# Altium schematic sheet Electronics_power_supply_DC_converter.SchDoc: Electronics power supply
size A3; SheetNumber: 2; SheetTotal: 6
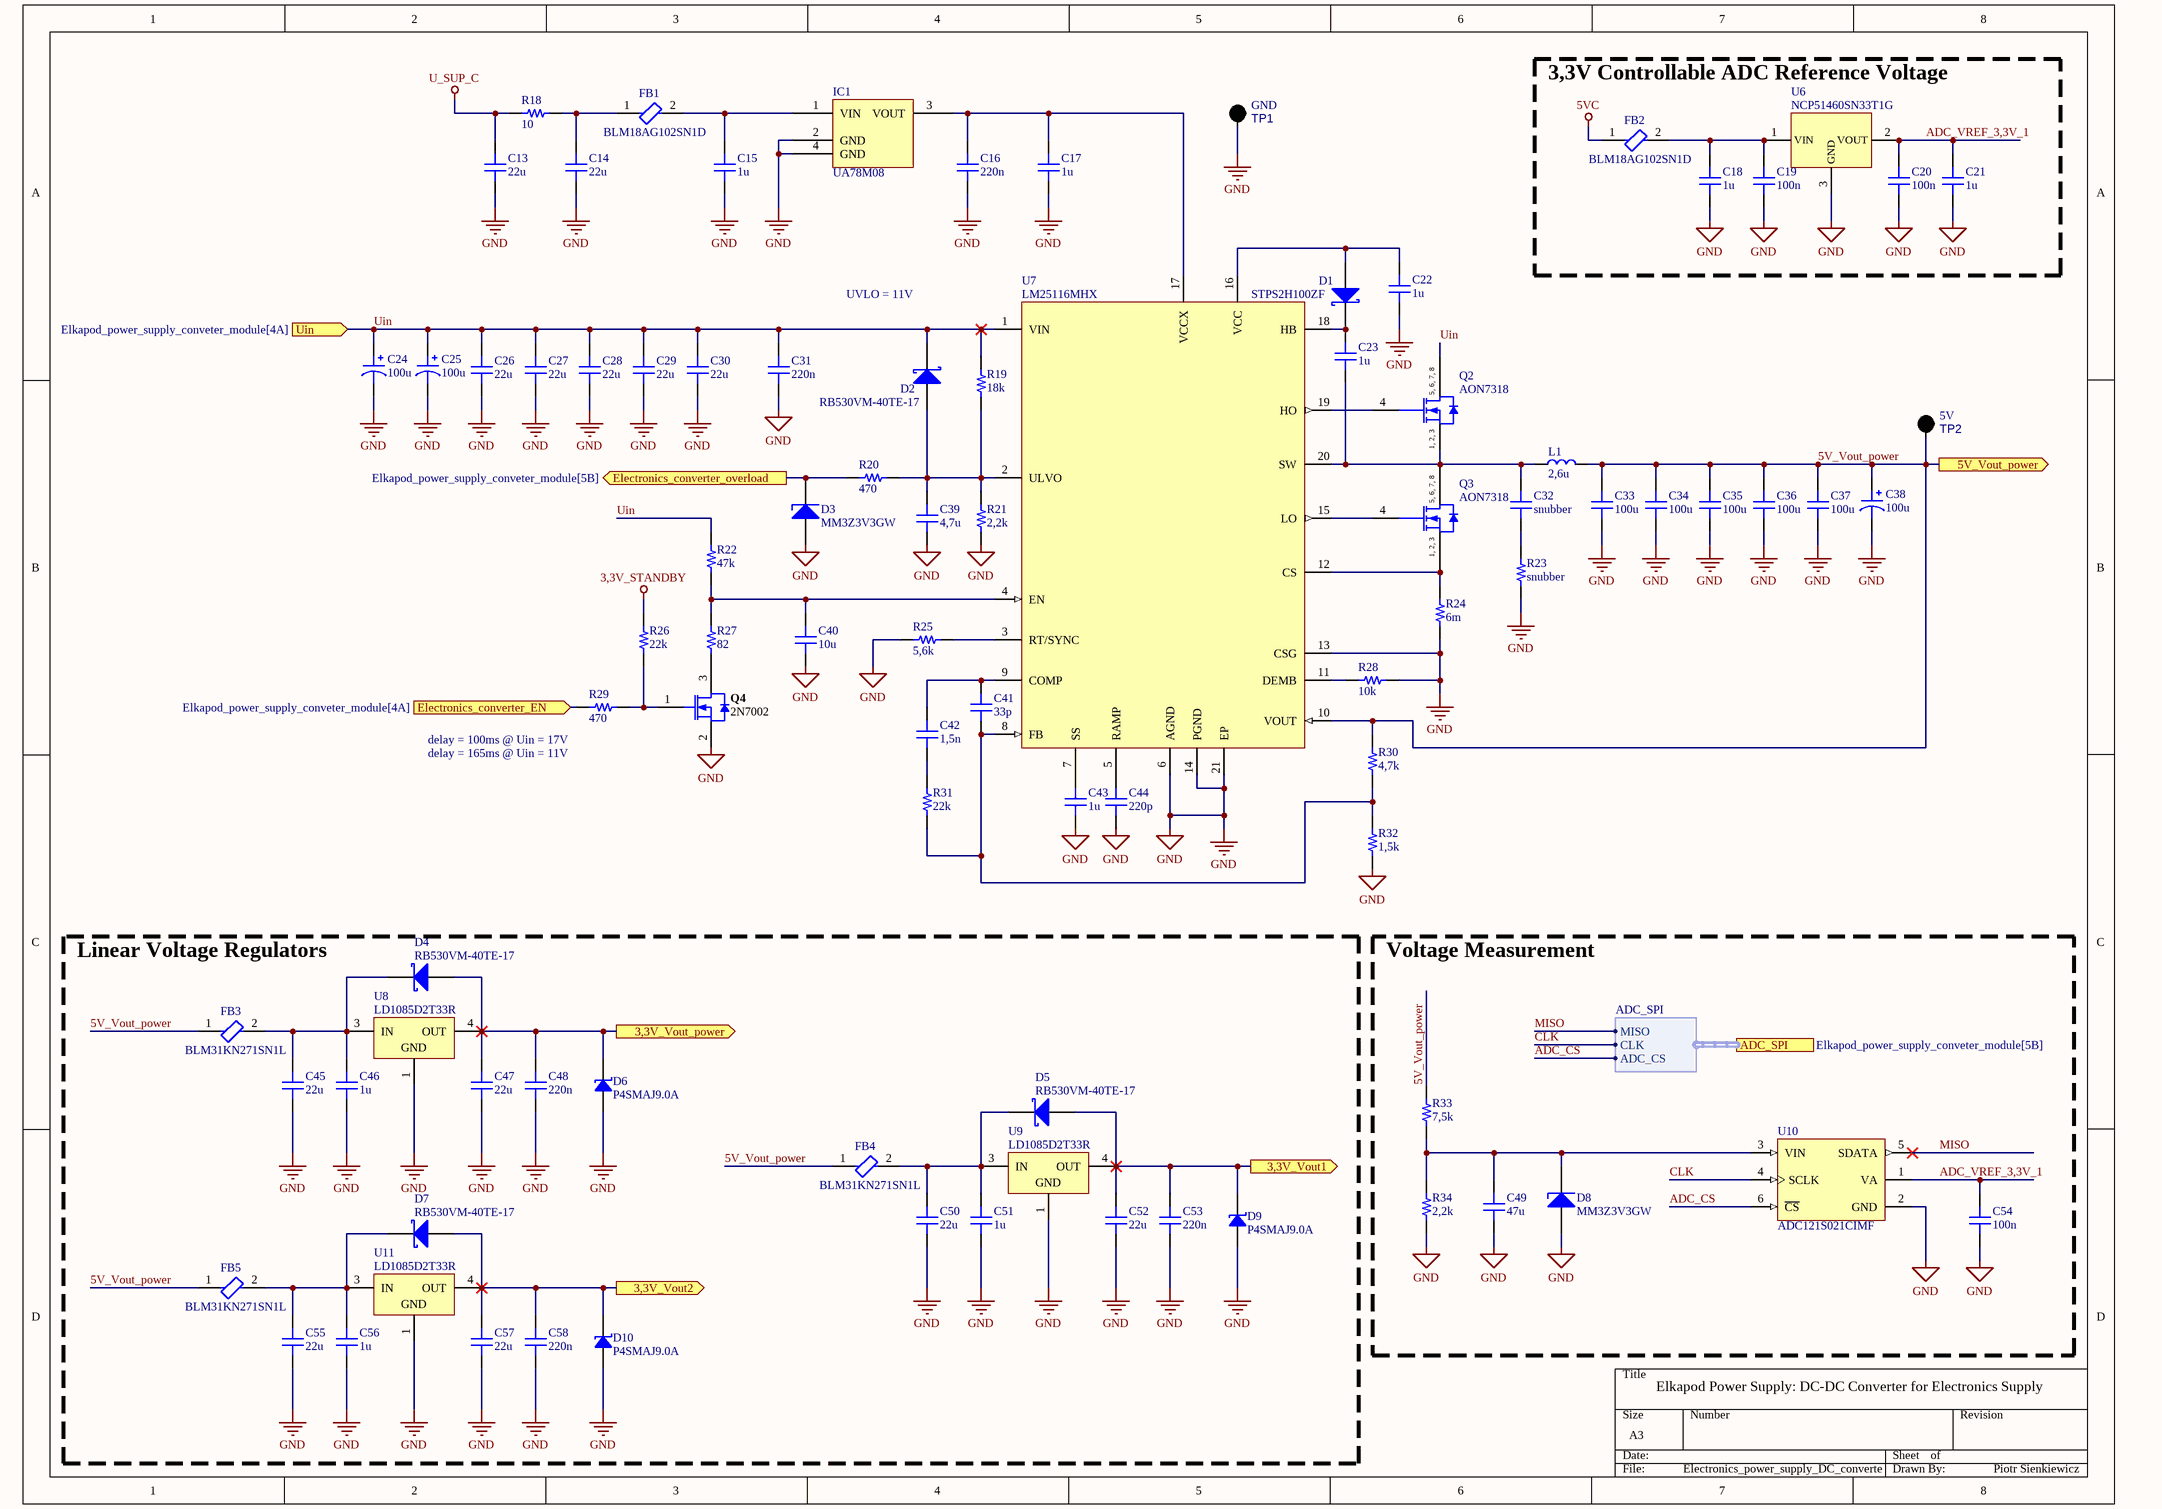
[diagram p0: Electronics_power_supply_DC_converter.SchDoc]

## Parts
C13  22u  [CAP 0805_2012]
C14  22u  [CAP 0805_2012]
C15  1u  [CAP 0603_1608]
C16  220n  [CAP 0603_1608]
C17  1u  [CAP 0603_1608]
C18  1u  [CAP 0603_1608]
C19  100n  [CAP 0603_1608]
C20  100n  [CAP 0603_1608]
C21  1u  [CAP 0603_1608]
C22  1u  [CAP 0603_1608]
C23  1u  [CAP 0603_1608]
C24  100u  [CAP ALSMD 8.3MM H10.5MM]
C25  100u  [CAP ALSMD 8.3MM H10.5MM]
C26  22u  [CAP 0805_2012]
C27  22u  [CAP 0805_2012]
C28  22u  [CAP 0805_2012]
C29  22u  [CAP 0805_2012]
C30  22u  [CAP 0805_2012]
C31  220n  [CAP 0603_1608]
C32  snubber  [CAP 0603_1608]
C33  100u  [CAP 1210_3225 - 1MM]
C34  100u  [CAP 1210_3225 - 1MM]
C35  100u  [CAP 1210_3225 - 1MM]
C36  100u  [CAP 1210_3225 - 1MM]
C37  100u  [CAP 1210_3225 - 1MM]
C38  100u  [CAP ALSMD 8.3MM H10.5MM]
C39  4,7u  [CAP 0603_1608]
C40  10u  [CAP 0603_1608]
C41  33p  [CAP 0603_1608]
C42  1,5n  [CAP 0603_1608]
C43  1u  [CAP 0603_1608]
C44  220p  [CAP 0603_1608]
C45  22u  [CAP 0805_2012]
C46  1u  [CAP 0603_1608]
C47  22u  [CAP 0805_2012]
C48  220n  [CAP 0603_1608]
C49  47u  [CAP 0603_1608]
C50  22u  [CAP 0805_2012]
C51  1u  [CAP 0603_1608]
C52  22u  [CAP 0805_2012]
C53  220n  [CAP 0603_1608]
C54  100n  [CAP 0603_1608]
C55  22u  [CAP 0805_2012]
C56  1u  [CAP 0603_1608]
C57  22u  [CAP 0805_2012]
C58  220n  [CAP 0603_1608]
D1  STPS2H100ZF  [DIOD-SOD-123-2_V]
D2  RB530VM-40TE-17  [SOD-323]
D3  MM3Z3V3GW  [SOD323]
D4  RB530VM-40TE-17  [SOD-323]
D5  RB530VM-40TE-17  [SOD-323]
D6  P4SMAJ9.0A  [DO214AC SMA]
D7  RB530VM-40TE-17  [SOD-323]
D8  MM3Z3V3GW  [SOD323]
D9  P4SMAJ9.0A  [DO214AC SMA]
D10  P4SMAJ9.0A  [DO214AC SMA]
FB1  BLM18AG102SN1D  [FP-BLM18-0_15-t0_8-MFG]
FB2  BLM18AG102SN1D  [FP-BLM18-0_15-t0_8-MFG]
FB3  BLM31KN271SN1L  [FP-BLM31-0_2-t1_6-d3_3-MFG]
FB4  BLM31KN271SN1L  [FP-BLM31-0_2-t1_6-d3_3-MFG]
FB5  BLM31KN271SN1L  [FP-BLM31-0_2-t1_6-d3_3-MFG]
IC1  UA78M08  [TI SOT-223 DCY]
L1  2,6u  [18,3x18,2_INDUCTOR]
Q2  AON7318  [DFN3,3x3,3]
Q3  AON7318  [DFN3,3x3,3]
Q4  2N7002  [INF-PG-SOT23_M]
R18  10  [RES 1206_3216]
R19  18k  [RES 0603_1608]
R20  470  [RES 0603_1608]
R21  2,2k  [RES 0603_1608]
R22  47k  [RES 0603_1608]
R23  snubber  [RES 1206_3216]
R24  6m  [STACKPOLE CSM2512]
R25  5,6k  [RES 0603_1608]
R26  22k  [RES 0603_1608]
R27  82  [RES 0603_1608]
R28  10k  [RES 0603_1608]
R29  470  [RES 0603_1608]
R30  4,7k  [RES 0603_1608]
R31  22k  [RES 0603_1608]
R32  1,5k  [RES 0603_1608]
R33  7,5k  [RES 0603_1608]
R34  2,2k  [RES 0603_1608]
TP1  GND  [Keystone_5006_BLACK]
TP2  5V  [Keystone_5006_BLACK]
U6  NCP51460SN33T1G  [SOT23-3]
U7  LM25116MHX  [PWP0020A_M]
U8  LD1085D2T33R  [TO-263_M]
U9  LD1085D2T33R  [TO-263_M]
U10  ADC121S021CIMF  [DBV0006A_M]
U11  LD1085D2T33R  [TO-263_M]

## Blocks framed on the sheet
3,3V Controllable ADC Reference Voltage: C18-C21 FB2 U6
Linear Voltage Regulators: C45-C48 C50-C53 C55-C58 D4-D7 D9 D10 FB3-FB5 U8 U9 U11
Voltage Measurement: C49 C54 D8 R33 R34 U10

## Ports
3,3V_Vout1 (out, see Elkapod_power_supply_conveter_module[5A]), 3,3V_Vout2 (out, see Elkapod_power_supply_conveter_module[5B]), 3,3V_Vout_power (out, see Elkapod_power_supply_conveter_module[5A]), 5V_Vout_power (out, see Elkapod_power_supply_conveter_module[5A]), ADC_SPI (harness ADC_SPI, see Elkapod_power_supply_conveter_module[5B]), Electronics_converter_EN (in, see Elkapod_power_supply_conveter_module[4A]), Electronics_converter_overload (out, see Elkapod_power_supply_conveter_module[5B]), Uin (in, see Elkapod_power_supply_conveter_module[4A])

## Harnesses
ADC_SPI: MISO, CLK, ADC_CS

## Nets
3,3V_STANDBY: R26.1
5VC: FB2.1
GND: C13.1 C14.1 C15.1 C16.1 C17.1 C18.1 C19.1 C20.1 C21.1 C22.2 C24.2 C25.2 C26.1 C27.1 C28.1 C29.1 C30.1 C31.1 C33.1 C34.1 C35.1 C36.1 C37.1 C38.2 C39.1 C40.1 C43.1 C44.1 C45.1 C46.1 C47.1 C48.1 C49.1 C50.1 C51.1 C52.1 C53.1 C54.1 C55.1 C56.1 C57.1 C58.1 D3.1(A) D6.1 D8.1(A) D9.1 D10.1 IC1.2(GND) IC1.4(GND) Q4.2(SOURCE) R21.1 R23.1 R24.1 R25.2 R28.1 R32.2 R34.2 TP1.0 U6.3(GND) U7.6(AGND) U7.13(CSG) U7.14(PGND) U7.21(EP) U8.1(GND) U9.1(GND) U10.2(GND) U11.1(GND)
U_SUP_C: C13.2 R18.1
3,3V_Vout1: C52.2 C53.2 D5.2(A) D9.2 U9.4(OUT) ; port 3,3V_Vout1
3,3V_Vout2: C57.2 C58.2 D7.2(A) D10.2 U11.4(OUT) ; port 3,3V_Vout2
3,3V_Vout_power: C47.2 C48.2 D4.2(A) D6.2 U8.4(OUT) ; port 3,3V_Vout_power
5V_Vout_power: C33.2 C34.2 C35.2 C36.2 C37.2 C38.1 FB3.1 FB4.1 FB5.1 L1.2 R30.1 R33.1 TP2.0 U7.10(VOUT) ; port 5V_Vout_power
ADC_CS: U10.6(~{CS}) ; port ADC_SPI.ADC_CS
ADC_VREF_3,3V_1: C20.2 C21.2 C54.2 U6.2(VOUT) U10.1(VA)
CLK: U10.4(SCLK) ; port ADC_SPI.CLK
Electronics_converter_EN: R29.1 ; port Electronics_converter_EN
Electronics_converter_overload: D3.2(K) R20.2 ; port Electronics_converter_overload
MISO: U10.5(SDATA) ; port ADC_SPI.MISO
Uin: C24.1 C25.1 C26.2 C27.2 C28.2 C29.2 C30.2 C31.2 D2.1(K) Q2.5(D) R19.1 R22.1 U7.1(VIN) ; port Uin
NetC14_2: C14.2 FB1.1 R18.2
NetC15_2: C15.2 FB1.2 IC1.1(VIN)
NetC16_2: C16.2 C17.2 IC1.3(VOUT) U7.17(VCCX)
NetC18_2: C18.2 C19.2 FB2.2 U6.1(VIN)
NetC22_1: C22.1 D1.1(A) U7.16(VCC)
NetC23_1: C23.1 C32.2 L1.1 Q2.1(S) Q3.5(D) U7.20(SW)
NetC23_2: C23.2 D1.2(K) U7.18(HB)
NetC32_1: C32.1 R23.2
NetC39_2: C39.2 D2.2(A) R19.2 R20.1 R21.2 U7.2(ULVO)
NetC40_2: C40.2 R22.2 R27.1 U7.4(EN)
NetC41_1: C41.1 C42.1 U7.9(COMP)
NetC41_2: C41.2 R30.2 R31.2 R32.1 U7.8(FB)
NetC42_2: C42.2 R31.1
NetC43_2: C43.2 U7.7(SS)
NetC44_2: C44.2 U7.5(RAMP)
NetC45_2: C45.2 C46.2 D4.1(K) FB3.2 U8.3(IN)
NetC49_2: C49.2 D8.2(K) R33.2 R34.1 U10.3(VIN)
NetC50_2: C50.2 C51.2 D5.1(K) FB4.2 U9.3(IN)
NetC55_2: C55.2 C56.2 D7.1(K) FB5.2 U11.3(IN)
NetQ2_4: Q2.4(G) U7.19(HO)
NetQ3_1: Q3.1(S) R24.2 U7.12(CS)
NetQ3_4: Q3.4(G) U7.15(LO)
NetQ4_1: Q4.1(GATE) R26.2 R29.2
NetQ4_3: Q4.3(DRAIN) R27.2
NetR25_1: R25.1 U7.3(RT/SYNC)
NetR28_2: R28.2 U7.11(DEMB)

## Notes on the sheet
- UVLO = 11V
- (near R29) delay = 100ms @ Uin = 17V
- (near R29) delay = 165ms @ Uin = 11V
- Elkapod Power Supply: DC-DC Converter for Electronics Supply
- Piotr Sienkiewicz
- (in symbol AON7318) 5, 6, 7, 8; 1, 2, 3

## Library data of the parts
C13 C14 C26-C30 C45 C47 C50 C52 C55 C57 = VJ0805Y684KXQTW1BC: CAP CER 22UF 25V X7R 0805; manufacturer: Vishay Vitramon; Tolerance: ±10%; Voltage - Rated: 10V; Part Number: VJ0805Y684KXQTW1BC; Value: 22u; Applications: General Purpose; Capacitance: 22u; componentlink1description: Datasheet; componentlink1url: https://www.vishay.com/docs/28548/vjw1bcbascomseries.pdf; componentlink2description: DigiKey Link; componentlink2url: https://www.digikey.com/en/products/detail/vishay-vitramon/VJ0805Y684KXQTW1BC/8313569; Device Package: 0805 (2012 Metric); lastupdated: 09.02.2024 20:13:13; Lifecycle Status: Active; Minimum Order: 1; Mounting Type: Surface Mount, MLCC; Operating Temperature: -55°C ~ 125°C; Package / Case: 0805 (2012 Metric); packaging: TapeAndReel; partid: 57262; price: 0.05; series: VJ W1BC; Size / Dimension: 0.079" L x 0.049" W (2.00mm x 1.25mm); Temperature Coefficient: X7R; Thickness (Max): 0.053" (1.35mm)
C15 C17 C22 C23 = C0603C272F3GAC7867: CAP CER 1uF 25V X5R 0603; manufacturer: KEMET; Temperature Coefficient: C0G, NP0; Tolerance: ±1%; Part Number: C0603C272F3GAC7867; Value: 1u; Applications: General Purpose; Capacitance: 1u; componentlink1description: Datasheet; componentlink1url: https://api.kemet.com/component-edge/download/datasheet/C0603C272F3GACTU.pdf; componentlink2description: DigiKey Link; componentlink2url: https://www.digikey.com/en/products/detail/kemet/C0603C272F3GAC7867/2200413; Device Package: 0603 (1608 Metric); Features: Low ESL; lastupdated: 09.02.2024 20:10:30; Lifecycle Status: Active; Minimum Order: 1; Mounting Type: Surface Mount, MLCC; Operating Temperature: -55°C ~ 125°C; Package / Case: 0603 (1608 Metric); packaging: TapeAndReel; partid: 2138; Part Status: Active; price: 0.40; series: SMD Comm C0G; Size / Dimension: 0.063" L x 0.031" W (1.60mm x 0.80mm); Thickness (Max): 0.034" (0.87mm); Voltage - Rated: 25V
C16 C31 C48 C53 C58 = C0603C272F3GAC7867: CAP CER 220nF 25V X5R 0603; manufacturer: KEMET; Temperature Coefficient: C0G, NP0; Tolerance: ±1%; Part Number: C0603C272F3GAC7867; Value: 220n; Applications: General Purpose; Capacitance: 220n; componentlink1description: Datasheet; componentlink1url: https://api.kemet.com/component-edge/download/datasheet/C0603C272F3GACTU.pdf; componentlink2description: DigiKey Link; componentlink2url: https://www.digikey.com/en/products/detail/kemet/C0603C272F3GAC7867/2200413; Device Package: 0603 (1608 Metric); Features: Low ESL; lastupdated: 09.02.2024 20:10:30; Lifecycle Status: Active; Minimum Order: 1; Mounting Type: Surface Mount, MLCC; Operating Temperature: -55°C ~ 125°C; Package / Case: 0603 (1608 Metric); packaging: TapeAndReel; partid: 2138; Part Status: Active; price: 0.40; series: SMD Comm C0G; Size / Dimension: 0.063" L x 0.031" W (1.60mm x 0.80mm); Thickness (Max): 0.034" (0.87mm); Voltage - Rated: 25V
C18 C21 C43 C46 C51 C56 = C0603C272F3GAC7867: CAP CER 1uF 16V X5R 0603; manufacturer: KEMET; Temperature Coefficient: C0G, NP0; Tolerance: ±1%; Voltage - Rated: 25V; Part Number: C0603C272F3GAC7867; Value: 1u; Applications: General Purpose; Capacitance: 1u; componentlink1description: Datasheet; componentlink1url: https://api.kemet.com/component-edge/download/datasheet/C0603C272F3GACTU.pdf; componentlink2description: DigiKey Link; componentlink2url: https://www.digikey.com/en/products/detail/kemet/C0603C272F3GAC7867/2200413; Device Package: 0603 (1608 Metric); Features: Low ESL; lastupdated: 09.02.2024 20:10:30; Lifecycle Status: Active; Minimum Order: 1; Mounting Type: Surface Mount, MLCC; Operating Temperature: -55°C ~ 125°C; Package / Case: 0603 (1608 Metric); packaging: TapeAndReel; partid: 2138; Part Status: Active; price: 0.40; series: SMD Comm C0G; Size / Dimension: 0.063" L x 0.031" W (1.60mm x 0.80mm); Thickness (Max): 0.034" (0.87mm)
C19 C20 C54 = C0603C272F3GAC7867: CAP CER 100nF 25V X5R 0603; manufacturer: KEMET; Temperature Coefficient: C0G, NP0; Tolerance: ±1%; Part Number: C0603C272F3GAC7867; Value: 100n; Applications: General Purpose; Capacitance: 100n; componentlink1description: Datasheet; componentlink1url: https://api.kemet.com/component-edge/download/datasheet/C0603C272F3GACTU.pdf; componentlink2description: DigiKey Link; componentlink2url: https://www.digikey.com/en/products/detail/kemet/C0603C272F3GAC7867/2200413; Device Package: 0603 (1608 Metric); Features: Low ESL; lastupdated: 09.02.2024 20:10:30; Lifecycle Status: Active; Minimum Order: 1; Mounting Type: Surface Mount, MLCC; Operating Temperature: -55°C ~ 125°C; Package / Case: 0603 (1608 Metric); packaging: TapeAndReel; partid: 2138; Part Status: Active; price: 0.40; series: SMD Comm C0G; Size / Dimension: 0.063" L x 0.031" W (1.60mm x 0.80mm); Thickness (Max): 0.034" (0.87mm); Voltage - Rated: 25V
C24 C25 C38 = EEE-TC1C101P: UCD1V101MNL1GS; CAP ALUM 100UF 20% 16V SMD; value: 100u
C32 = C0603C272F3GAC7867: CAP CER 50V X5R 0603; manufacturer: KEMET; Temperature Coefficient: C0G, NP0; Tolerance: ±1%; Voltage - Rated: 25V; Part Number: C0603C272F3GAC7867; Value: snubber; Applications: General Purpose; Capacitance: snubber; componentlink1description: Datasheet; componentlink1url: https://api.kemet.com/component-edge/download/datasheet/C0603C272F3GACTU.pdf; componentlink2description: DigiKey Link; componentlink2url: https://www.digikey.com/en/products/detail/kemet/C0603C272F3GAC7867/2200413; Device Package: 0603 (1608 Metric); Features: Low ESL; lastupdated: 09.02.2024 20:10:30; Lifecycle Status: Active; Minimum Order: 1; Mounting Type: Surface Mount, MLCC; Operating Temperature: -55°C ~ 125°C; Package / Case: 0603 (1608 Metric); packaging: TapeAndReel; partid: 2138; Part Status: Active; price: 0.40; series: SMD Comm C0G; Size / Dimension: 0.063" L x 0.031" W (1.60mm x 0.80mm); Thickness (Max): 0.034" (0.87mm)
C33-C37 = CAN13X104KARAC7800: CAP CER 1210 100UF 10V X7R; manufacturer: KEMET; Tolerance: ±10%; Voltage - Rated: 250VAC; Part Number: CAN13X104KARAC7800; Value: 100u; Applications: Boardflex Sensitive; Capacitance: 100u; componentlink1description: Datasheet; componentlink1url: //media.digikey.com/pdf/Data%20Sheets/Kemet%20PDFs/CAN13X104KARACTU_Spec.pdf; componentlink2description: DigiKey Link; componentlink2url: https://www.digikey.com/en/products/detail/kemet/CAN13X104KARAC7800/9962480; Device Package: 1210 (3225 Metric); Features: Low ESL, Soft Termination; lastupdated: 04.06.2024 19:21:07; Lifecycle Status: Active; Minimum Order: 1; Mounting Type: Surface Mount, MLCC; Operating Temperature: -55°C ~ 125°C; Package / Case: 1210 (3225 Metric); packaging: TapeAndReel; partid: 23615; Part Status: Active; price: 0.39; series: CAN SMD Indust X7R; Size / Dimension: 0.130" L x 0.102" W (3.30mm x 2.60mm); Temperature Coefficient: X7R; Thickness (Max): 0.110" (2.80mm)
C39 = C0603C272F3GAC7867: CAP CER 4,7uF 25V X5R 0603; manufacturer: KEMET; Temperature Coefficient: C0G, NP0; Tolerance: ±1%; Part Number: C0603C272F3GAC7867; Value: 4,7u; Applications: General Purpose; Capacitance: 4,7u; componentlink1description: Datasheet; componentlink1url: https://api.kemet.com/component-edge/download/datasheet/C0603C272F3GACTU.pdf; componentlink2description: DigiKey Link; componentlink2url: https://www.digikey.com/en/products/detail/kemet/C0603C272F3GAC7867/2200413; Device Package: 0603 (1608 Metric); Features: Low ESL; lastupdated: 09.02.2024 20:10:30; Lifecycle Status: Active; Minimum Order: 1; Mounting Type: Surface Mount, MLCC; Operating Temperature: -55°C ~ 125°C; Package / Case: 0603 (1608 Metric); packaging: TapeAndReel; partid: 2138; Part Status: Active; price: 0.40; series: SMD Comm C0G; Size / Dimension: 0.063" L x 0.031" W (1.60mm x 0.80mm); Thickness (Max): 0.034" (0.87mm); Voltage - Rated: 25V
C40 = C0603C272F3GAC7867: CAP CER 10uF 35V X5R 0603; manufacturer: KEMET; Temperature Coefficient: C0G, NP0; Tolerance: ±1%; Voltage - Rated: 25V; Part Number: C0603C272F3GAC7867; Value: 10u; Applications: General Purpose; Capacitance: 10u; componentlink1description: Datasheet; componentlink1url: https://api.kemet.com/component-edge/download/datasheet/C0603C272F3GACTU.pdf; componentlink2description: DigiKey Link; componentlink2url: https://www.digikey.com/en/products/detail/kemet/C0603C272F3GAC7867/2200413; Device Package: 0603 (1608 Metric); Features: Low ESL; lastupdated: 09.02.2024 20:10:30; Lifecycle Status: Active; Minimum Order: 1; Mounting Type: Surface Mount, MLCC; Operating Temperature: -55°C ~ 125°C; Package / Case: 0603 (1608 Metric); packaging: TapeAndReel; partid: 2138; Part Status: Active; price: 0.40; series: SMD Comm C0G; Size / Dimension: 0.063" L x 0.031" W (1.60mm x 0.80mm); Thickness (Max): 0.034" (0.87mm)
C41 = C0603C272F3GAC7867: CAP CER 33pF 50V G0C 0603; manufacturer: KEMET; Temperature Coefficient: C0G, NP0; Tolerance: ±1%; Voltage - Rated: 25V; Part Number: C0603C272F3GAC7867; Value: 33p; Applications: General Purpose; Capacitance: 33p; componentlink1description: Datasheet; componentlink1url: https://api.kemet.com/component-edge/download/datasheet/C0603C272F3GACTU.pdf; componentlink2description: DigiKey Link; componentlink2url: https://www.digikey.com/en/products/detail/kemet/C0603C272F3GAC7867/2200413; Device Package: 0603 (1608 Metric); Features: Low ESL; lastupdated: 09.02.2024 20:10:30; Lifecycle Status: Active; Minimum Order: 1; Mounting Type: Surface Mount, MLCC; Operating Temperature: -55°C ~ 125°C; Package / Case: 0603 (1608 Metric); packaging: TapeAndReel; partid: 2138; Part Status: Active; price: 0.40; series: SMD Comm C0G; Size / Dimension: 0.063" L x 0.031" W (1.60mm x 0.80mm); Thickness (Max): 0.034" (0.87mm)
C42 = C0603C272F3GAC7867: CAP CER 1,5nF 50V G0C 0603; manufacturer: KEMET; Temperature Coefficient: C0G, NP0; Tolerance: ±1%; Voltage - Rated: 25V; Part Number: C0603C272F3GAC7867; Value: 1,5n; Applications: General Purpose; Capacitance: 1,5n; componentlink1description: Datasheet; componentlink1url: https://api.kemet.com/component-edge/download/datasheet/C0603C272F3GACTU.pdf; componentlink2description: DigiKey Link; componentlink2url: https://www.digikey.com/en/products/detail/kemet/C0603C272F3GAC7867/2200413; Device Package: 0603 (1608 Metric); Features: Low ESL; lastupdated: 09.02.2024 20:10:30; Lifecycle Status: Active; Minimum Order: 1; Mounting Type: Surface Mount, MLCC; Operating Temperature: -55°C ~ 125°C; Package / Case: 0603 (1608 Metric); packaging: TapeAndReel; partid: 2138; Part Status: Active; price: 0.40; series: SMD Comm C0G; Size / Dimension: 0.063" L x 0.031" W (1.60mm x 0.80mm); Thickness (Max): 0.034" (0.87mm)
C44 = C0603C272F3GAC7867: CAP CER 220pF 50V G0C 0603; manufacturer: KEMET; Temperature Coefficient: C0G, NP0; Tolerance: ±1%; Voltage - Rated: 25V; Part Number: C0603C272F3GAC7867; Value: 220p; Applications: General Purpose; Capacitance: 220p; componentlink1description: Datasheet; componentlink1url: https://api.kemet.com/component-edge/download/datasheet/C0603C272F3GACTU.pdf; componentlink2description: DigiKey Link; componentlink2url: https://www.digikey.com/en/products/detail/kemet/C0603C272F3GAC7867/2200413; Device Package: 0603 (1608 Metric); Features: Low ESL; lastupdated: 09.02.2024 20:10:30; Lifecycle Status: Active; Minimum Order: 1; Mounting Type: Surface Mount, MLCC; Operating Temperature: -55°C ~ 125°C; Package / Case: 0603 (1608 Metric); packaging: TapeAndReel; partid: 2138; Part Status: Active; price: 0.40; series: SMD Comm C0G; Size / Dimension: 0.063" L x 0.031" W (1.60mm x 0.80mm); Thickness (Max): 0.034" (0.87mm)
C49 = C0603C272F3GAC7867: CAP CER 47uF 6,3V X5R 0603; manufacturer: KEMET; Temperature Coefficient: C0G, NP0; Tolerance: ±1%; Voltage - Rated: 25V; Part Number: C0603C272F3GAC7867; Value: 47u; Applications: General Purpose; Capacitance: 47u; componentlink1description: Datasheet; componentlink1url: https://api.kemet.com/component-edge/download/datasheet/C0603C272F3GACTU.pdf; componentlink2description: DigiKey Link; componentlink2url: https://www.digikey.com/en/products/detail/kemet/C0603C272F3GAC7867/2200413; Device Package: 0603 (1608 Metric); Features: Low ESL; lastupdated: 09.02.2024 20:10:30; Lifecycle Status: Active; Minimum Order: 1; Mounting Type: Surface Mount, MLCC; Operating Temperature: -55°C ~ 125°C; Package / Case: 0603 (1608 Metric); packaging: TapeAndReel; partid: 2138; Part Status: Active; price: 0.40; series: SMD Comm C0G; Size / Dimension: 0.063" L x 0.031" W (1.60mm x 0.80mm); Thickness (Max): 0.034" (0.87mm)
D1 = CMP-0303-00004-1: Schottky diode; 2A; 100V
D2 D4 D5 D7 = BAS140W: Schottky diode; 0,1A; 40V; Published: 21-Mar-2003; LatestRevisionDate: 19-Mar-2004; LatestRevisionNote: Silkscreen size reduced.; DatasheetDocument: Oct-1999; PackageDocument: Sep-2000; PackageReference: SOD-323; Publisher: Altium Limited; ComponentLink1Description: Manufacturer Link; ComponentLink1URL: http://www.infineon.com/; ComponentLink2Description: Datasheet; ComponentLink2URL: http://www.infineon.com/upload/Document/cmc_upload/documents/009/386/bas70_bas170series_1.pdf
D3 D8 = Zener_Diode_SOD323: 3,3V, 0,3W Zener diode; SOD323
D6 D9 D10 = SMA6J18A-TP: TVS DIODE 9VDC DO214AC; Part Number: P4SMAJ9.0A
FB1 FB2 = CMP-0686-00457-3: Chip Ferrite Bead, 0603, 1000Ω @ 100MHz, 0.5Ω, 25%, 450mA; Number of Circuits: 1; Max DC Current: 400mA; Shielding: Unshielded; DC Resistance (DCR): 500mR; Material: Steel; DC Resistance-Max: 700mR; Impedance: 1kR; Case Code (Imperial): 0603; Max Current Rating: 400mA; Frequency: 100MHz; Min Operating Temperature: -55°C; Case/Package: 0603; Depth: 0.8mm; Lead Free: Lead Free; Core Material: Ferrite; Current Rating: 400mA; Resistance: 500mR; Case Code (Metric): 1608; DC Current: 400mA; Package Quantity: 1; Packaging: Tape and Reel; Width: 0.8mm; Military Standard: Not; Height: 0.8mm; Series: BLM18A; Max Operating Temperature: 125°C; Tolerance: 25%; Termination: SMD/SMT; Test Frequency: 100MHz; Number of Lines: 1; Number of Pins: 2; REACH SVHC: No SVHC; Length: 1.6mm; Radiation Hardening: No
FB3-FB5 = CMP-06046-002074-1: Chip Ferrite Bead, 1206, 270Ω @ 100MHz, 0.016Ω, 25%, 4.5A; DC Resistance (DCR): 16mR; Number of Lines: 1; Mount: Surface Mount; Case Code (Imperial): 1206; Case/Package: 1206; Packaging: Cut Tape; Min Operating Temperature: -55°C; Max Current Rating: 4.5A; Case Code (Metric): 3216; Max Operating Temperature: 125°C
IC1 = LM340MP-5.0/NOPB: IC REG LINEAR 8V 0,5A SOT223; Manufacturer: Texas Instruments; Current - Output: 1.5A; Number of Regulators: 1; Output Configuration: Positive; Output Type: Fixed; Part Number: UA78M08; ComponentLink1Description: Datasheet; ComponentLink1URL: http://www.ti.com/general/docs/suppproductinfo.tsp?distId=10&gotoUrl=http%3A%2F%2Fwww.ti.com%2Flit%2Fgpn%2Flm340; ComponentLink2Description: DigiKey Link; ComponentLink2URL: //digikey.com/product-detail/en/texas-instruments/LM340MP-5.0-NOPB/LM340MP-5.0-NOPBTR-ND/270717; Lifecycle Status: 0; Operating Temperature: 0°C ~ 125°C; Package / Case: TO-261-4, TO-261AA; Packaging: TapeAndReel; Voltage - Output (Min/Fixed): 8V
L1 = 18,3x18,2_INDUCTOR: Power inductor, 2,6uH, Imax = 25,5A, Isat = 50A
Q2 Q3 = AON7318: Ultra Fast N-MOSFET; 50A; 30V; DFN3,3x3,3
Q4 = CMP-1149-00026-1: N-Channel OptiMOS Small-Signal-Transistor, 60 V VDS, 0.3 A ID, -55 to 150 degC, PG-SOT23, Reel, Green; Manufacturer: Infineon; RDS (on) (max) (@4.5V): 4,000 mOhm; VDS (max): 60 V; IDpuls (max): 1.2Â A; QG: 0.4Â nC; RDS (on) (max): 3,000 mOhm; RthJA (max): 250 K/W; ID (max): 0.3Â A; VGS(th) (max): 2.5Â V; VGS(th) (min): 1.5Â V; Green: TRUE; Ptot (max): 0.5Â W; PackageDescription: 3-Pin Small Outline Transistor Package, 2.9 x 1.3 mm Body, 0.95 mm Pitch; Halogen-free: TRUE; ComponentLink2Description: Datasheet; ComponentLink1URL: http://www.infineon.com/; Packing: Reel; DatasheetVersion: Rev. 2.4; PartNumber: 2N7002; PackageReference: PG-SOT23; PackageVersion: Apr-08; ComponentLink3URL: http://www.infineon.com/dgdl/SOT23-Package_Overview.pdf?folderId=db3a30431936bc4b0119532290053c66&fileId=db3a30431936bc4b0119533468123c85; ComponentLink1Description: Manufacturer URL; Mounting Technology: Surface Mount; ComponentLink3Description: Package Specification; ComponentLink2URL: http://www.infineon.com/dgdl/2N7002_Rev2.4.pdf?folderId=db3a3043156fd573011622e10b5c1f67&fileId=db3a304319bc939a0119c2a9461e79e6
R18 = KRL1632E-M-R120-F-T5: RES 10 OHM 1% 3/4W 1206; Manufacturer: Susumu; Power (Watts): 0.75W, 3/4W; Temperature Coefficient: ±50ppm/°C; Part Number: KRL1632E-M-R120-F-T5; ComponentLink1Description: Datasheet; ComponentLink1URL: http://www.susumu.co.jp/common/pdf/n_catalog_partition09_en.pdf; ComponentLink2Description: DigiKey Link; ComponentLink2URL: https://www.digikey.com/en/products/detail/susumu/KRL1632E-M-R120-F-T5/3738009; Composition: Metal Foil; Device Package: 1206 (3216 Metric); Features: Automotive AEC-Q200, Current Sense; Height - Seated (Max): 0.028" (0.70mm); LastUpdated: 09.02.2024 20:54:46; Lifecycle Status: Active; Minimum Order: 1; Number of Terminations: 2; Operating Temperature: -55°C ~ 155°C; Package / Case: 1206 (3216 Metric); Packaging: TapeAndReel; PartId: 26840; Part Status: Active; Price: 0.09; Ratings: AEC-Q200; Resistance: 10; Series: KRL; Size / Dimension: 0.126" L x 0.063" W (3.20mm x 1.60mm); Supplier Device Package: 1206; Tolerance: ±1%; Value: 10
R19 = RNCS0603BKE10K0: RES 18K OHM 1% 0,1W 0603; Manufacturer: Stackpole Electronics Inc; Power (Watts): 0.063W, 1/16W; Temperature Coefficient: ±25ppm/°C; Tolerance: ±0.1%; Part Number: RNCS0603BKE10K0; Value: 18k; Composition: Thin Film; Device Package: 0603 (1608 Metric); Features: Anti-Corrosive, Automotive AEC-Q200, Moisture Resistant; Height - Seated (Max): 0.022" (0.55mm); LastUpdated: 09.02.2024 20:43:37; Lifecycle Status: Active; Minimum Order: 1; Number of Terminations: 2; Operating Temperature: -55°C ~ 155°C; Package / Case: 0603 (1608 Metric); Packaging: TapeAndReel; PartId: 4838; Part Status: Active; Price: 0.06; Ratings: AEC-Q200; Resistance: 18k; Series: RNCS; Size / Dimension: 0.061" L x 0.031" W (1.55mm x 0.80mm); Supplier Device Package: 0603
R20 R29 = RNCS0603BKE10K0: RES 470 OHM 1% 0,1W 0603; Manufacturer: Stackpole Electronics Inc; Power (Watts): 0.063W, 1/16W; Temperature Coefficient: ±25ppm/°C; Tolerance: ±0.1%; Part Number: RNCS0603BKE10K0; Value: 470; Composition: Thin Film; Device Package: 0603 (1608 Metric); Features: Anti-Corrosive, Automotive AEC-Q200, Moisture Resistant; Height - Seated (Max): 0.022" (0.55mm); LastUpdated: 09.02.2024 20:43:37; Lifecycle Status: Active; Minimum Order: 1; Number of Terminations: 2; Operating Temperature: -55°C ~ 155°C; Package / Case: 0603 (1608 Metric); Packaging: TapeAndReel; PartId: 4838; Part Status: Active; Price: 0.06; Ratings: AEC-Q200; Resistance: 470; Series: RNCS; Size / Dimension: 0.061" L x 0.031" W (1.55mm x 0.80mm); Supplier Device Package: 0603
R21 R34 = RNCS0603BKE10K0: RES 2,2K OHM 1% 0,1W 0603; Manufacturer: Stackpole Electronics Inc; Power (Watts): 0.063W, 1/16W; Temperature Coefficient: ±25ppm/°C; Tolerance: ±0.1%; Part Number: RNCS0603BKE10K0; Value: 2,2k; Composition: Thin Film; Device Package: 0603 (1608 Metric); Features: Anti-Corrosive, Automotive AEC-Q200, Moisture Resistant; Height - Seated (Max): 0.022" (0.55mm); LastUpdated: 09.02.2024 20:43:37; Lifecycle Status: Active; Minimum Order: 1; Number of Terminations: 2; Operating Temperature: -55°C ~ 155°C; Package / Case: 0603 (1608 Metric); Packaging: TapeAndReel; PartId: 4838; Part Status: Active; Price: 0.06; Ratings: AEC-Q200; Resistance: 2,2k; Series: RNCS; Size / Dimension: 0.061" L x 0.031" W (1.55mm x 0.80mm); Supplier Device Package: 0603
R22 = RNCS0603BKE10K0: RES 47K OHM 1% 0,1W 0603; Manufacturer: Stackpole Electronics Inc; Power (Watts): 0.063W, 1/16W; Temperature Coefficient: ±25ppm/°C; Tolerance: ±0.1%; Part Number: RNCS0603BKE10K0; Value: 47k; Composition: Thin Film; Device Package: 0603 (1608 Metric); Features: Anti-Corrosive, Automotive AEC-Q200, Moisture Resistant; Height - Seated (Max): 0.022" (0.55mm); LastUpdated: 09.02.2024 20:43:37; Lifecycle Status: Active; Minimum Order: 1; Number of Terminations: 2; Operating Temperature: -55°C ~ 155°C; Package / Case: 0603 (1608 Metric); Packaging: TapeAndReel; PartId: 4838; Part Status: Active; Price: 0.06; Ratings: AEC-Q200; Resistance: 47k; Series: RNCS; Size / Dimension: 0.061" L x 0.031" W (1.55mm x 0.80mm); Supplier Device Package: 0603
R23 = KRL1632E-M-R120-F-T5: Manufacturer: Susumu; Power (Watts): 0.75W, 3/4W; Temperature Coefficient: ±50ppm/°C; Tolerance: ±1%; Part Number: KRL1632E-M-R120-F-T5; Composition: Metal Foil; Device Package: 1206 (3216 Metric); Features: Automotive AEC-Q200, Current Sense; Height - Seated (Max): 0.028" (0.70mm); LastUpdated: 09.02.2024 20:54:46; Lifecycle Status: Active; Minimum Order: 1; Number of Terminations: 2; Operating Temperature: -55°C ~ 155°C; Package / Case: 1206 (3216 Metric); Packaging: TapeAndReel; PartId: 26840; Part Status: Active; Price: 0.09; Ratings: AEC-Q200; Resistance: snubber; Series: KRL; Size / Dimension: 0.126" L x 0.063" W (3.20mm x 1.60mm); Supplier Device Package: 1206; Value: snubber
R24 = CSM2512FT20L0: RES 0,006 OHM 1% 3W 2512; manufacturer: Stackpole Electronics Inc; Temperature Coefficient: ±50ppm/°C; value: 20 mOhms; Part Number: CSM2512FT20L0; componentlink1description: Datasheet; componentlink1url: https://www.seielect.com/Catalog/SEI-CSM.PDF; componentlink2description: DigiKey Link; componentlink2url: https://www.digikey.com/en/products/detail/stackpole-electronics-inc/CSM2512FT20L0/6270239; Composition: Metal Element; Device Package: 2512 (6332 Metric); Features: Current Sense; Height - Seated (Max): 0.035" (0.90mm); lastupdated: 03.06.2024 20:27:03; Lifecycle Status: Active; Minimum Order: 4000; Number of Terminations: 2; Operating Temperature: -55°C ~ 170°C; Package / Case: 2512 (6332 Metric); packaging: TapeAndReel; Part Status: Active; Power (Watts): 3W; price: 0.19; Resistance: 6m; series: CSM; Size / Dimension: 0.252" L x 0.126" W (6.40mm x 3.20mm); Supplier Device Package: 2512; Tolerance: ±1%
R25 = RNCS0603BKE10K0: RES 5,6K OHM 1% 0,1W 0603; Manufacturer: Stackpole Electronics Inc; Power (Watts): 0.063W, 1/16W; Temperature Coefficient: ±25ppm/°C; Tolerance: ±0.1%; Part Number: RNCS0603BKE10K0; Value: 5,6k; Composition: Thin Film; Device Package: 0603 (1608 Metric); Features: Anti-Corrosive, Automotive AEC-Q200, Moisture Resistant; Height - Seated (Max): 0.022" (0.55mm); LastUpdated: 09.02.2024 20:43:37; Lifecycle Status: Active; Minimum Order: 1; Number of Terminations: 2; Operating Temperature: -55°C ~ 155°C; Package / Case: 0603 (1608 Metric); Packaging: TapeAndReel; PartId: 4838; Part Status: Active; Price: 0.06; Ratings: AEC-Q200; Resistance: 5,6k; Series: RNCS; Size / Dimension: 0.061" L x 0.031" W (1.55mm x 0.80mm); Supplier Device Package: 0603
R26 R31 = RNCS0603BKE10K0: RES 22K OHM 1% 0,1W 0603; Manufacturer: Stackpole Electronics Inc; Power (Watts): 0.063W, 1/16W; Temperature Coefficient: ±25ppm/°C; Tolerance: ±0.1%; Part Number: RNCS0603BKE10K0; Value: 22k; Composition: Thin Film; Device Package: 0603 (1608 Metric); Features: Anti-Corrosive, Automotive AEC-Q200, Moisture Resistant; Height - Seated (Max): 0.022" (0.55mm); LastUpdated: 09.02.2024 20:43:37; Lifecycle Status: Active; Minimum Order: 1; Number of Terminations: 2; Operating Temperature: -55°C ~ 155°C; Package / Case: 0603 (1608 Metric); Packaging: TapeAndReel; PartId: 4838; Part Status: Active; Price: 0.06; Ratings: AEC-Q200; Resistance: 22k; Series: RNCS; Size / Dimension: 0.061" L x 0.031" W (1.55mm x 0.80mm); Supplier Device Package: 0603
R27 = RNCS0603BKE10K0: RES 82 OHM 1% 0,1W 0603; Manufacturer: Stackpole Electronics Inc; Power (Watts): 0.063W, 1/16W; Temperature Coefficient: ±25ppm/°C; Tolerance: ±0.1%; Part Number: RNCS0603BKE10K0; Value: 82; Composition: Thin Film; Device Package: 0603 (1608 Metric); Features: Anti-Corrosive, Automotive AEC-Q200, Moisture Resistant; Height - Seated (Max): 0.022" (0.55mm); LastUpdated: 09.02.2024 20:43:37; Lifecycle Status: Active; Minimum Order: 1; Number of Terminations: 2; Operating Temperature: -55°C ~ 155°C; Package / Case: 0603 (1608 Metric); Packaging: TapeAndReel; PartId: 4838; Part Status: Active; Price: 0.06; Ratings: AEC-Q200; Resistance: 82; Series: RNCS; Size / Dimension: 0.061" L x 0.031" W (1.55mm x 0.80mm); Supplier Device Package: 0603
R28 = RNCS0603BKE10K0: RES 10K OHM 1% 0,1W 0603; Manufacturer: Stackpole Electronics Inc; Power (Watts): 0.063W, 1/16W; Temperature Coefficient: ±25ppm/°C; Tolerance: ±0.1%; Part Number: RNCS0603BKE10K0; Value: 10k; Composition: Thin Film; Device Package: 0603 (1608 Metric); Features: Anti-Corrosive, Automotive AEC-Q200, Moisture Resistant; Height - Seated (Max): 0.022" (0.55mm); LastUpdated: 09.02.2024 20:43:37; Lifecycle Status: Active; Minimum Order: 1; Number of Terminations: 2; Operating Temperature: -55°C ~ 155°C; Package / Case: 0603 (1608 Metric); Packaging: TapeAndReel; PartId: 4838; Part Status: Active; Price: 0.06; Ratings: AEC-Q200; Resistance: 10k; Series: RNCS; Size / Dimension: 0.061" L x 0.031" W (1.55mm x 0.80mm); Supplier Device Package: 0603
R30 = RNCS0603BKE10K0: RES 4,7K OHM 1% 0,1W 0603; Manufacturer: Stackpole Electronics Inc; Power (Watts): 0.063W, 1/16W; Temperature Coefficient: ±25ppm/°C; Tolerance: ±0.1%; Part Number: RNCS0603BKE10K0; Value: 4,7k; Composition: Thin Film; Device Package: 0603 (1608 Metric); Features: Anti-Corrosive, Automotive AEC-Q200, Moisture Resistant; Height - Seated (Max): 0.022" (0.55mm); LastUpdated: 09.02.2024 20:43:37; Lifecycle Status: Active; Minimum Order: 1; Number of Terminations: 2; Operating Temperature: -55°C ~ 155°C; Package / Case: 0603 (1608 Metric); Packaging: TapeAndReel; PartId: 4838; Part Status: Active; Price: 0.06; Ratings: AEC-Q200; Resistance: 4,7k; Series: RNCS; Size / Dimension: 0.061" L x 0.031" W (1.55mm x 0.80mm); Supplier Device Package: 0603
R32 = RNCS0603BKE10K0: RES 1,5K OHM 1% 0,1W 0603; Manufacturer: Stackpole Electronics Inc; Power (Watts): 0.063W, 1/16W; Temperature Coefficient: ±25ppm/°C; Tolerance: ±0.1%; Part Number: RNCS0603BKE10K0; Value: 1,5k; Composition: Thin Film; Device Package: 0603 (1608 Metric); Features: Anti-Corrosive, Automotive AEC-Q200, Moisture Resistant; Height - Seated (Max): 0.022" (0.55mm); LastUpdated: 09.02.2024 20:43:37; Lifecycle Status: Active; Minimum Order: 1; Number of Terminations: 2; Operating Temperature: -55°C ~ 155°C; Package / Case: 0603 (1608 Metric); Packaging: TapeAndReel; PartId: 4838; Part Status: Active; Price: 0.06; Ratings: AEC-Q200; Resistance: 1,5k; Series: RNCS; Size / Dimension: 0.061" L x 0.031" W (1.55mm x 0.80mm); Supplier Device Package: 0603
R33 = RNCS0603BKE10K0: RES 7,5K OHM 1% 0,1W 0603; Manufacturer: Stackpole Electronics Inc; Power (Watts): 0.063W, 1/16W; Temperature Coefficient: ±25ppm/°C; Tolerance: ±0.1%; Part Number: RNCS0603BKE10K0; Value: 7,5k; Composition: Thin Film; Device Package: 0603 (1608 Metric); Features: Anti-Corrosive, Automotive AEC-Q200, Moisture Resistant; Height - Seated (Max): 0.022" (0.55mm); LastUpdated: 09.02.2024 20:43:37; Lifecycle Status: Active; Minimum Order: 1; Number of Terminations: 2; Operating Temperature: -55°C ~ 155°C; Package / Case: 0603 (1608 Metric); Packaging: TapeAndReel; PartId: 4838; Part Status: Active; Price: 0.06; Ratings: AEC-Q200; Resistance: 7,5k; Series: RNCS; Size / Dimension: 0.061" L x 0.031" W (1.55mm x 0.80mm); Supplier Device Package: 0603
TP1 TP2 = Keystone 5006 Test Point: Keystone 5006 Test Point (BLACK)
U6 = NCP51460SN33T1G: Low power precision voltage reference; Iout = 20mA
U7 = LM25116MHX: Wide Range Synchronous Buck Controller, 20-pin TSSOP-EP, Pb-Free
U8 U9 U11 = CMP-0244-00169-1: 3A, Low Drop Positive Voltage Regulator, 3.3V, 3-Pin D2PAK; ComponentLink1URL: http://www.st.com; PackageVersion: 2011; ComponentLink1Description: Manufacturer URL; ComponentLink2URL: http://www.st.com/internet/com/TECHNICAL_RESOURCES/TECHNICAL_LITERATURE/DATASHEET/CD00001883.pdf; PackageDescription: 3-Pin Transistor Outline Package 2.54 mm Pitch, 15.4 mm Lead Span (D2PAK); DatasheetVersion: 28/07/2009; ComponentLink2Description: Datasheet; PackageReference: TO-263
U10 = CMP-0054-00268-3: Single Channel, 50 to 200 kSPS, 12-Bit A/D Converter, 6-pin SOT-23; Manufacturer: Texas Instruments; PackageTopMarking: X07C*XTT; CompType: ADC IC; PowerWise: Y; Code_IPC: SOT26A-6; PackageReference: DBV0006A; ComponentLink1Description: Datasheet URL; PinCount: 6; ComponentLink1URL: http://www.ti.com/general/docs/lit/getliterature.tsp?genericPartNumber=ADC121S021&fileType=pdf; PackageDescription: Molded SOT-23, .115 x .063 x .040in Body, 6 Lead, .0375in in Pitch; RoHS: N; Code_JEDEC: MO-178-AB